# EAGLE board E-P-206-R1.2 Fuel Cell Control (Board to Board) (EAGLE 7.4.0), part 1 of 2
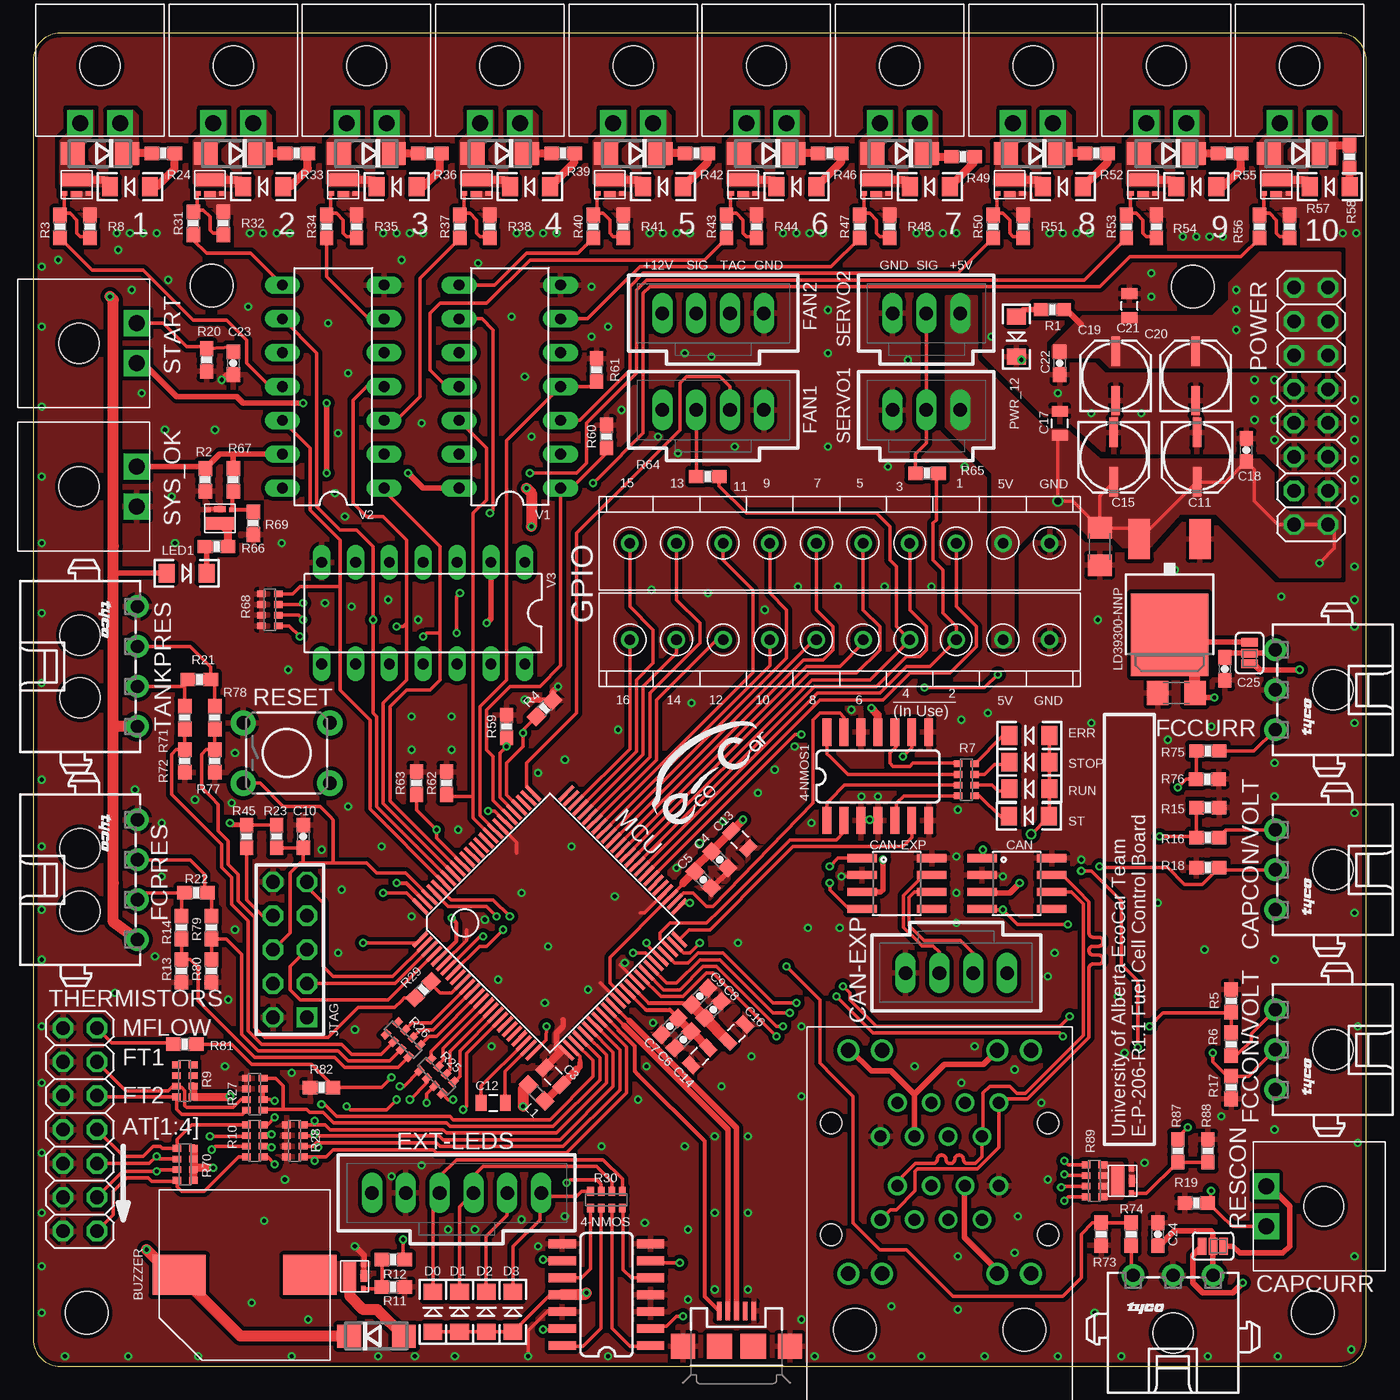
[diagram p5: board, top side]
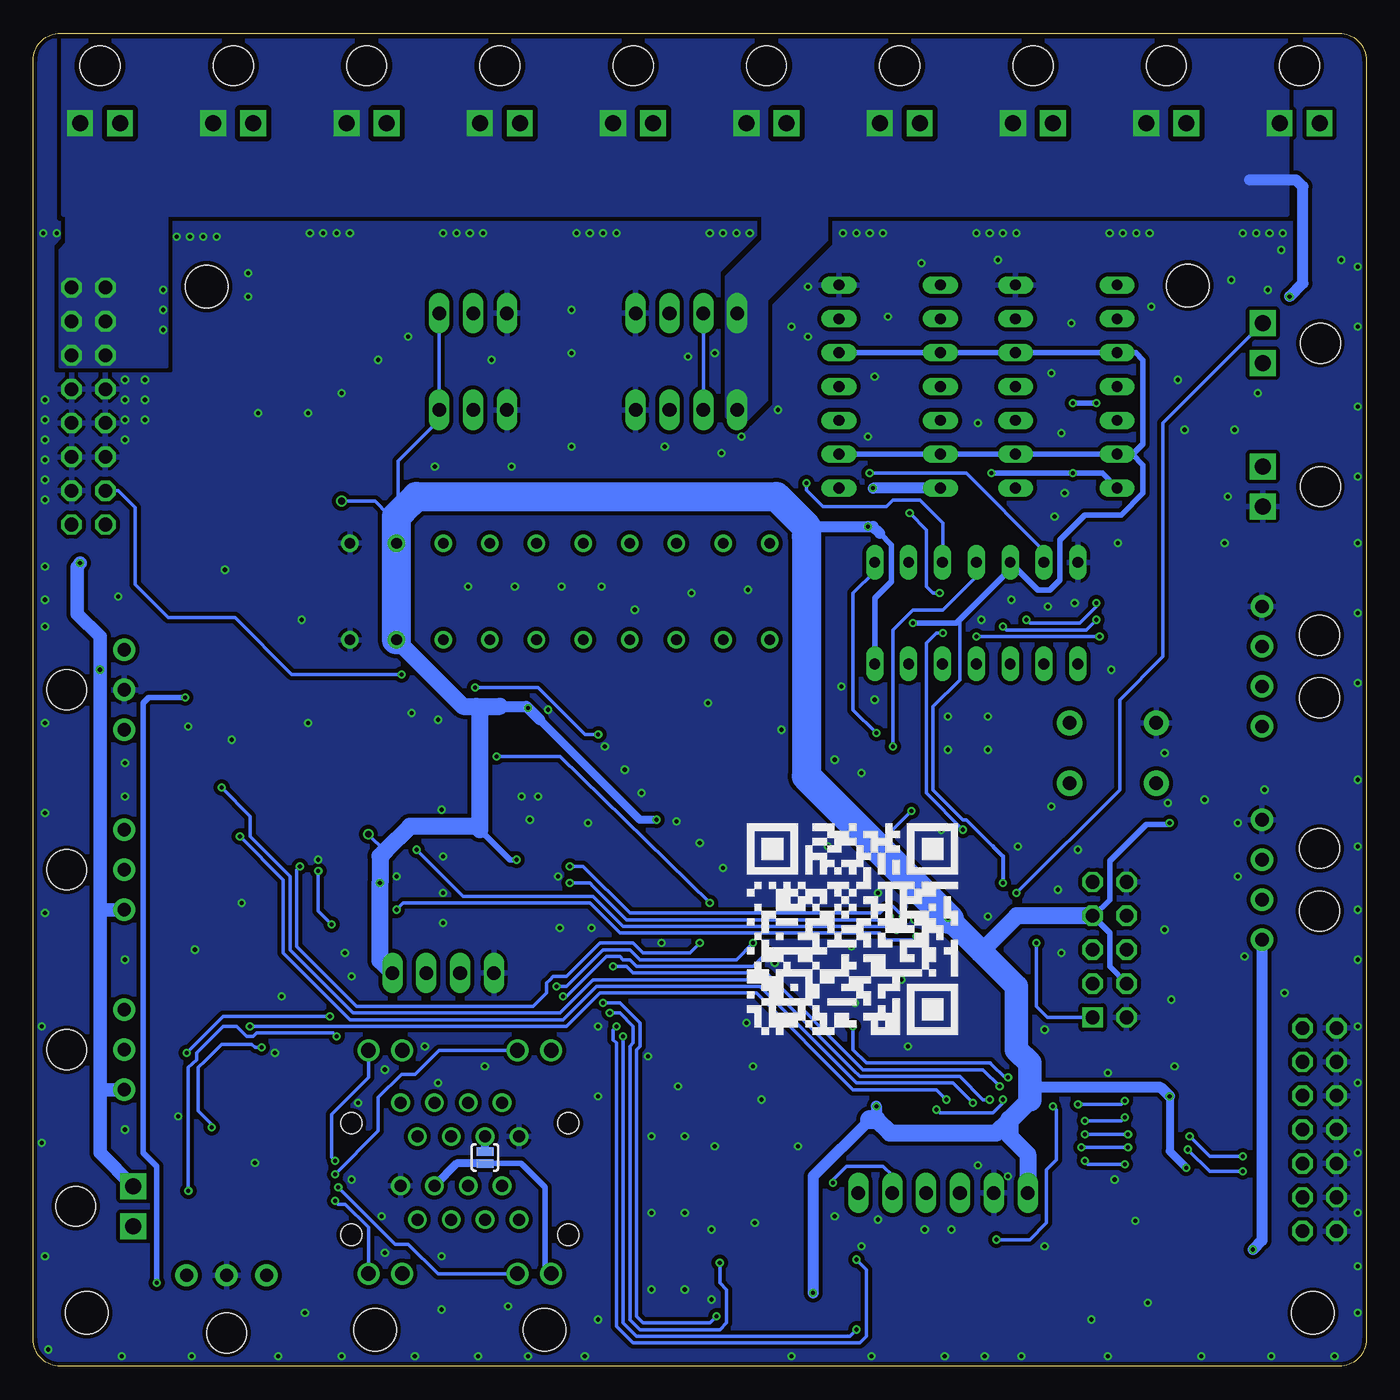
[diagram p6: board, bottom side, seen from below]

Size 100 x 100 mm. Coordinates in mm from the lower left corner, seen from the top.
Outline: 0,98 0,2 arc90 2,0 98,0 arc90 100,2 100,98 arc90 98,100 2,100 arc90 0,98
Copper layers (1*16): Top 0.035mm / dielectric 1.5mm / Bottom 0.035mm
Design rules "SeeedStudio_2layer_DRU_no_angle_20140221": minimum track width 6mil, minimum drill 12mil, track to track 6mil, track to pad 6mil, pad to pad 6mil, via to via 6mil, smd to smd 0mil, copper to edge 10mil, drill to drill 10mil, minimum pad ring 10mil, minimum via ring 6mil, stop-mask expansion 2mil, vias tented up to drill 100mil, thermal gap 10mil
Holes 3.2 mm at 4,4 96,4 13.37,81.08 87,81

## Footprints (pad centres in the part's own frame; a part is rotated, then mirrored left to right if it is on the bottom)
SOIC-14 = smd 0.66 x 2.032: 1 -4.445,-3.315; 2 -3.175,-3.315; 3 -1.905,-3.315; 4 -0.635,-3.315; 5 0.635,-3.315; 6 1.905,-3.315; 7 3.175,-3.315; 8 3.175,3.315; 9 1.905,3.315; 10 0.635,3.315; 11 -0.635,3.315; 12 -1.905,3.315; 13 -3.175,3.315; 14 -4.445,3.315
CT-1212CL-SMT = smd 4 x 3: + -4.9,0; - 4.9,0
1206 = smd 1.6 x 1.8: 1 -1.4,0; 2 1.4,0
0805 = smd 0.8 x 1.2: 1 -0.9,0; 2 0.9,0
0603-CAP = smd 1.1 x 1: 1 -0.85,0; 2 0.85,0
PANASONIC_C = smd 2.2 x 0.65: + 1.9,-0.2; - -1.8,-0.2
70543-04 = drill 1.016 long: 1 -3.81,0; 2 -1.27,0; 3 1.27,0; 4 3.81,0
1445055-3 = drill 1 pad 1.676: 1 3,4.32; 2 0,4.32; 3 -3,4.32 | hole 3: 0,0
LED-1206 = smd 1.2 x 1.4: A -1.5,0; C 1.5,0
70543-06 = drill 1.016 long: 1 -6.35,0; 2 -3.81,0; 3 -1.27,0; 4 1.27,0; 5 3.81,0; 6 6.35,0
1445055-4 = drill 1 pad 1.676: 1 4.5,4.32; 2 1.5,4.32; 3 -1.5,4.32; 4 -4.5,4.32 | hole 3: -2.35,0; 2.35,0
SJ_3_PASTE1&2 = smd 0.635 x 1.27: 1 -0.813,0; 2 0,0; 3 0.813,0
USB-MICROB = smd 0.35 x 1.4: D+ 0,2.65; D- -0.65,2.65; GND 1.3,2.65; ID 0.65,2.65; VBUS -1.3,2.65 | smd 1.8 x 1.9: MT1 -4,0; MT2 4,0 | smd 1.9 x 1.9: P$1 -1.27,0; P$2 1.27,0
SJ_2S-NO = smd 0.635 x 1.27: 1 -0.45,0; 2 0.45,0
AVR-JTAG-10 = drill 1.016 square: 1 -5.08,-1.27 | drill 1.016 octagon: 2 -5.08,1.27; 3 -2.54,-1.27; 4 -2.54,1.27; 5 0,-1.27; 6 0,1.27; 7 2.54,-1.27; 8 2.54,1.27; 9 5.08,-1.27; 10 5.08,1.27
0603 = smd 1.1 x 1: 1 -0.85,0; 2 0.85,0
DPACK = smd 1.6 x 3: 1 -2.28,-4.8; 3 2.28,-4.8 | smd 5.8 x 6.2: 4 0,2.38
TQFP100 = smd 0.27 x 1.5: 1 -6,-7.75; 2 -5.5,-7.75; 3 -5,-7.75; 4 -4.5,-7.75; 5 -4,-7.75; 6 -3.5,-7.75; 7 -3,-7.75; 8 -2.5,-7.75; 9 -2,-7.75; 10 -1.5,-7.75; 11 -1,-7.75; 12 -0.5,-7.75; 13 0,-7.75; 14 0.5,-7.75; 15 1,-7.75; 16 1.5,-7.75; 17 2,-7.75; 18 2.5,-7.75; 19 3,-7.75; 20 3.5,-7.75; 21 4,-7.75; 22 4.5,-7.75; 23 5,-7.75; 24 5.5,-7.75; 25 6,-7.75; 51 6,7.75; 52 5.5,7.75; 53 5,7.75; 54 4.5,7.75; 55 4,7.75; 56 3.5,7.75; 57 3,7.75; 58 2.5,7.75; 59 2,7.75; 60 1.5,7.75; 61 1,7.75; 62 0.5,7.75; 63 0,7.75; 64 -0.5,7.75; 65 -1,7.75; 66 -1.5,7.75; 67 -2,7.75; 68 -2.5,7.75; 69 -3,7.75; 70 -3.5,7.75; 71 -4,7.75; 72 -4.5,7.75; 73 -5,7.75; 74 -5.5,7.75; 75 -6,7.75 | smd 1.5 x 0.27: 26 7.75,-6; 27 7.75,-5.5; 28 7.75,-5; 29 7.75,-4.5; 30 7.75,-4; 31 7.75,-3.5; 32 7.75,-3; 33 7.75,-2.5; 34 7.75,-2; 35 7.75,-1.5; 36 7.75,-1; 37 7.75,-0.5; 38 7.75,0; 39 7.75,0.5; 40 7.75,1; 41 7.75,1.5; 42 7.75,2; 43 7.75,2.5; 44 7.75,3; 45 7.75,3.5; 46 7.75,4; 47 7.75,4.5; 48 7.75,5; 49 7.75,5.5; 50 7.75,6; 76 -7.75,6; 77 -7.75,5.5; 78 -7.75,5; 79 -7.75,4.5; 80 -7.75,4; 81 -7.75,3.5; 82 -7.75,3; 83 -7.75,2.5; 84 -7.75,2; 85 -7.75,1.5; 86 -7.75,1; 87 -7.75,0.5; 88 -7.75,0; 89 -7.75,-0.5; 90 -7.75,-1; 91 -7.75,-1.5; 92 -7.75,-2; 93 -7.75,-2.5; 94 -7.75,-3; 95 -7.75,-3.5; 96 -7.75,-4; 97 -7.75,-4.5; 98 -7.75,-5; 99 -7.75,-5.5; 100 -7.75,-6
2X08 = drill 1.016 octagon: 1 -8.89,-1.27; 2 -8.89,1.27; 3 -6.35,-1.27; 4 -6.35,1.27; 5 -3.81,-1.27; 6 -3.81,1.27; 7 -1.27,-1.27; 8 -1.27,1.27; 9 1.27,-1.27; 10 1.27,1.27; 11 3.81,-1.27; 12 3.81,1.27; 13 6.35,-1.27; 14 6.35,1.27; 15 8.89,-1.27; 16 8.89,1.27
0603-RES = smd 1.1 x 1: 1 -0.85,0; 2 0.85,0
0603-ARV = smd 0.5 x 0.65: 1 -1.2,-0.625; 2 -0.4,-0.625; 3 0.4,-0.625; 4 1.2,-0.625; 5 1.2,0.625; 6 0.4,0.625; 7 -0.4,0.625; 8 -1.2,0.625
43650-0200 = drill 1.2 pad 1.93 square: P$1 -1.5,0; P$2 1.5,0 | hole 3: 0,-4.32
TACTILE-PTH = drill 1.016 pad 1.88: 1 -3.251,2.261; 2 3.251,2.261; 3 -3.251,-2.261; 4 3.251,-2.261
70543-03 = drill 1.016 long: 1 -2.54,0; 2 0,0; 3 2.54,0
2X07 = drill 1.016 octagon: 1 -7.62,-1.27; 2 -7.62,1.27; 3 -5.08,-1.27; 4 -5.08,1.27; 5 -2.54,-1.27; 6 -2.54,1.27; 7 0,-1.27; 8 0,1.27; 9 2.54,-1.27; 10 2.54,1.27; 11 5.08,-1.27; 12 5.08,1.27; 13 7.62,-1.27; 14 7.62,1.27
2XETHERNET = drill 0.9: B_1 -4.44,8.25; B_2 -3.17,10.79; B_3 -1.9,8.25; B_4 -0.63,10.79; B_5 0.64,8.25; B_6 1.91,10.79; B_7 3.18,8.25; B_8 4.45,10.79; T_1 4.45,17.02; T_2 3.18,14.48; T_3 1.91,17.02; T_4 0.64,14.48; T_5 -0.63,17.02; T_6 -1.9,14.48; T_7 -3.17,17.02; T_8 -4.44,14.48 | drill 1.1: B_9 -6.86,4.19; B_10 -4.32,4.19; B_11 4.32,4.19; B_12 6.86,4.19; T_9 -6.86,20.95; T_10 -4.32,20.95; T_11 4.32,20.95; T_12 6.86,20.95 | hole 3.2: -6.35,0; 6.35,0 | hole 1.6: -8.13,15.49; 8.13,15.49; -8.13,7.11; 8.13,7.11
10X1PCBBLOCK = drill 0.8: 1 -15.75,0; 2 -12.25,0; 3 -8.75,0; 4 -5.25,0; 5 -1.75,0; 6 1.75,0; 7 5.25,0; 8 8.75,0; 9 12.25,0; 10 15.75,0
8-SOIC = smd 0.61 x 2.21: 1 0.635,-0.076; 2 1.905,-0.076; 3 3.175,-0.076; 4 4.445,-0.076; 5 4.445,5.156; 6 3.175,5.156; 7 1.905,5.156; 8 0.635,5.156
SC70-6L = smd 0.95 x 2.4: D 0,0 | smd 0.35 x 0.5: G 1.01,-0.95; S@0 1.01,0.95 | smd 0.45 x 0.87: S@1 1.05,0
DO214AC = smd 1.8 x 1.7: A 2.05,0; C -2.05,0
DIL14 = drill 0.813 long: 1 -7.62,-3.81; 2 -5.08,-3.81; 3 -2.54,-3.81; 4 0,-3.81; 5 2.54,-3.81; 6 5.08,-3.81; 7 7.62,-3.81; 8 7.62,3.81; 9 5.08,3.81; 10 2.54,3.81; 11 0,3.81; 12 -2.54,3.81; 13 -5.08,3.81; 14 -7.62,3.81

## Placement (x,y rotation side)
4-NMOS  ALD1106PBL  [SOIC-14]  43,6 90 top
4-NMOS1  ALD1106PBL  [SOIC-14]  64,44.25 0 top
BUZZER  BUZZER-CT-1212CL-SMT  [CT-1212CL-SMT]  15.85,6.85 0 top
C1  NNP  [1206]  80,61.5 270 top
C2  NNP  [1206]  85.75,50.5 180 top
C3  100uF  [0805]  39,21.75 135 top
C4  100nF  [0603-CAP]  51.5,38 315 top
C5  1nF  [0603-CAP]  50.25,36.5 315 top
C6  100nF  [0603-CAP]  48.75,24.5 225 top
C7  470pF  [0603-CAP]  47.75,25.5 225 top
C8  100nF  [0603-CAP]  51,26.75 45 top
C9  470pF  [0603-CAP]  50,27.75 45 top
C10  22nF  [0603-CAP]  20.25,39.75 270 top
C11  100uF  [PANASONIC_C]  87.5,68.25 270 top
C12  100nF  [0805]  34.5,19.75 0 top
C13  4.7uF  [0805]  53,39.5 315 top
C14  4.7uF  [0805]  50,23.25 225 top
C15  100uF  [PANASONIC_C]  81.25,68.25 270 top
C16  2.2uF  [0805]  52.75,25 45 top
C17  1uF  [0805]  77,70.75 90 top
C18  10nF  [0603-CAP]  91,68.75 90 top
C19  100uF  [PANASONIC_C]  81,74.25 90 top
C20  100uF  [PANASONIC_C]  87,74.25 90 top
C21  1uF  [0805]  82.23,79.56 90 top
C22  10nF  [0603-CAP]  77,75.25 270 top
C23  100nF  [0603-CAP]  15,75.25 270 top
C24  100nF  [0603-CAP]  84.37,9.91 90 top
C25  100nF  [0603-CAP]  89.39,52.32 270 top
CAN-EXP  C-GRID-04-70543  [70543-04]  69.25,29.5 180 top
CAPCON/VOLT  1445055-3  [1445055-3]  97.5,37.25 90 top
CAPCURR  1445055-3  [1445055-3]  85.5,2.5 0 top
D0  [LED-1206]  29.98,4.06 90 top
D1  [LED-1206]  31.98,4.06 90 top
D2  [LED-1206]  33.98,4.06 90 top
D3  [LED-1206]  35.98,4.06 90 top
EXT-LEDS  C-GRID-06-70543  [70543-06]  31.75,13 0 top
FAN1  C-GRID-04-70543  [70543-04]  51,71.75 0 top
FAN2  C-GRID-04-70543  [70543-04]  51,79 0 top
FCCON/VOLT  1445055-3  [1445055-3]  97.5,23.75 90 top
FCCURR  1445055-3  [1445055-3]  97.5,50.75 90 top
FCPRES  1445055-4  [1445055-4]  3.5,36.5 270 top
JP1  JUMPER-31-2  [SJ_3_PASTE1&2]  88.5,9 180 top
JP2  USB  [USB-MICROB]  52.75,1.5 0 top
JP3  JUMPER-31-2  [SJ_3_PASTE1&2]  91.25,53.5 90 top
JP4  [SJ_2S-NO]  66.12,15.66 270 bottom
JTAG  2x5  [AVR-JTAG-10]  19.25,31.25 90 top
L1  BLM18KG221SN1D  [0603]  37.75,20.5 135 top
LD39300-NNP  LD117ADT50TR  [DPACK]  85.25,57.25 180 top
LED1  [LED-1206]  11.5,59.5 0 top
LED6  [LED-1206]  7.25,88.5 180 top
LED7  [LED-1206]  17.25,88.5 180 top
LED8  [LED-1206]  27.25,88.5 180 top
LED9  [LED-1206]  37.25,88.5 180 top
LED10  [LED-1206]  47.25,88.5 180 top
LED11  [LED-1206]  57.25,88.5 180 top
LED12  [LED-1206]  67.25,88.5 180 top
LED13  [LED-1206]  77.25,88.5 180 top
LED14  [LED-1206]  87.25,88.5 180 top
LED15  [LED-1206]  97.25,88.5 180 top
LERROR  RED  [LED-1206]  74.73,47.31 180 top
LRUN  GREEN  [LED-1206]  74.73,43.31 180 top
LSTART  BLUE  [LED-1206]  74.71,41.27 180 top
LSTOP  YELLOW  [LED-1206]  74.73,45.31 180 top
MCU  AT32UC3C1512  [TQFP100]  38.75,33.25 315 top
POWER  [2X08]  95.87,72.03 270 top
PWR_12  GREEN  [LED-1206]  73.75,77.25 270 top
R1  1k  [0603-RES]  76.46,79.27 0 top
R2  10k\  [0603-RES]  12.9,66.5 90 top
R3  1k  [0603-RES]  2,85.5 90 top
R4  10k  [0603-RES]  38.35,49.35 45 top
R5  3k 1%  [0603-RES]  89.87,27.41 90 top
R6  47k 1%  [0603-RES]  89.87,24.16 90 top
R7  470  [0603-ARV]  70,44 270 top
R8  10k  [0603-RES]  4.25,85.5 270 top
R9  100k  [0603-ARV]  11.37,21.41 90 top
R10  10k  [0603-ARV]  16.62,16.91 270 top
R11  10k  [0603-RES]  27,5.95 180 top
R12  1k  [0603-RES]  27,8 180 top
R13  47k 1%  [0603-RES]  11.12,29.66 90 top
R14  31.6k 1%  [0603-RES]  11.12,32.91 90 top
R15  3k 1%  [0603-RES]  88.12,41.91 0 top
R16  47k 1%  [0603-RES]  88.12,39.66 180 top
R17  4.7k  [0603-RES]  89.87,20.91 270 top
R18  4.7k  [0603-RES]  88.12,37.41 180 top
R19  4.7k  [0603-RES]  87.25,12.25 180 top
R20  4.7k  [0603-RES]  13,75.5 270 top
R21  10k  [0603-RES]  12.46,51.52 180 top
R22  10k  [0603-RES]  12.21,35.52 180 top
R23  10k  [0603-RES]  18.25,39.75 90 top
R24  1k  [0603-RES]  9.75,91 180 top
R25  10k  [0603-ARV]  30.25,21.75 135 top
R26  10k  [0603-ARV]  27.75,24.5 135 top
R27  10k  [0603-ARV]  16.62,20.41 270 top
R28  10k  [0603-ARV]  19.62,16.91 270 top
R29  10k  [0603-RES]  29.25,28.25 45 top
R30  470  [0603-ARV]  43,12.5 0 top
R31  1k  [0603-RES]  12,85.75 90 top
R32  10k  [0603-RES]  14.25,85.75 270 top
R33  1k  [0603-RES]  19.75,91 180 top
R34  1k  [0603-RES]  22,85.5 90 top
R35  10k  [0603-RES]  24.25,85.5 270 top
R36  1k  [0603-RES]  29.75,91 180 top
R37  1k  [0603-RES]  32,85.5 90 top
R38  10k  [0603-RES]  34.25,85.5 270 top
R39  1k  [0603-RES]  39.75,91 180 top
R40  1k  [0603-RES]  42,85.5 90 top
R41  10k  [0603-RES]  44.25,85.5 270 top
R42  1k  [0603-RES]  49.75,91 180 top
R43  1k  [0603-RES]  52,85.5 90 top
R44  10k  [0603-RES]  54.25,85.5 270 top
R45  10k  [0603-RES]  16,39.75 90 top
R46  1k  [0603-RES]  59.75,91 180 top
R47  1k  [0603-RES]  62,85.5 90 top
R48  10k  [0603-RES]  64.25,85.5 270 top
R49  1k  [0603-RES]  69.75,90.75 180 top
R50  1k  [0603-RES]  72,85.5 90 top
R51  10k  [0603-RES]  74.25,85.5 270 top
R52  1k  [0603-RES]  79.75,91 180 top
R53  1k  [0603-RES]  82,85.5 90 top
R54  10k  [0603-RES]  84.25,85.5 270 top
R55  1k  [0603-RES]  89.75,91 180 top
R56  1k  [0603-RES]  92,85.5 90 top
R57  10k  [0603-RES]  94.25,85.5 270 top
R58  1k  [0603-RES]  98.75,90.75 90 top
R59  10k  [0603-RES]  35.5,48 90 top
R60  10k  [0603-RES]  43,69.75 90 top
R61  10k  [0603-RES]  42.25,74.75 90 top
R62  10k  [0603-RES]  31,43.75 90 top
R63  10k  [0603-RES]  28.75,43.75 90 top
R64  10k  [0603-RES]  50.6,66.75 180 top
R65  10k  [0603-RES]  67.05,67 180 top
R66  1k  [0603-RES]  13.75,61.5 0 top
R67  1k  [0603-RES]  15,66.5 270 top
R68  10k  [0603-ARV]  17.75,56.75 90 top
R69  10k  [0603-RES]  16.5,63.25 90 top
R70  100k  [0603-ARV]  11.4,15.15 90 top
R71  31.6k 1%  [0603-RES]  11.37,48.66 90 top
R72  47k 1%  [0603-RES]  11.37,45.41 90 top
R73  47k 1%  [0603-RES]  80.12,9.91 90 top
R74  31.6k 1%  [0603-RES]  82.37,9.91 270 top
R75  31.6k 1%  [0603-RES]  88.12,46.16 0 top
R76  47k 1%  [0603-RES]  88.08,44.04 180 top
R77  31.6k 1%  [0603-RES]  13.62,48.66 90 top
R78  47k 1%  [0603-RES]  13.62,45.41 90 top
R79  31.6k 1%  [0603-RES]  13.37,32.91 90 top
R80  47k 1%  [0603-RES]  13.37,29.66 90 top
R81  31.6k 1%  [0603-RES]  11.37,24.16 180 top
R82  47k 1%  [0603-RES]  21.62,20.91 0 top
R87  1k  [0603-RES]  85.87,16.16 90 top
R88  10k  [0603-RES]  88.12,16.16 90 top
R89  1k  [0603-ARV]  79.62,13.91 90 top
RESCON  43650-0200  [43650-0200]  92.5,12 90 top
RESET  SWITCH-MOMENTARY-2PTH  [TACTILE-PTH]  19,46 0 top
SERVO1  C-GRID-03-70543  [70543-03]  67,71.75 0 top
SERVO2  C-GRID-03-70543  [70543-03]  67,79 0 top
START  43650-0200  [43650-0200]  7.75,76.75 270 top
SYS_OK  43650-0200  [43650-0200]  7.75,66 270 top
TANKPRES  1445055-4  [1445055-4]  3.5,52.5 270 top
THERMISTORS  [2X07]  3.5,17.75 90 top
U$1  2XETHERNET  [2XETHERNET]  68,2.75 0 top
U$2  10X1PCBBLOCK  [10X1PCBBLOCK]  60.5,61.75 0 top
U$3  10X1PCBBLOCK  [10X1PCBBLOCK]  60.5,54.5 180 top
U$4  MCP2551  [8-SOIC]  71.25,38.75 270 top
U$5  SIA448DJ-T1  [SC70-6L]  3.25,89 270 top
U$6  43650-0200  [43650-0200]  5,93.25 180 top
U$7  [DO214AC]  5,91 180 top
U$8  SIA448DJ-T1  [SC70-6L]  13.25,89 270 top
U$9  43650-0200  [43650-0200]  15,93.25 180 top
U$10  [DO214AC]  15,91 180 top
U$11  SIA448DJ-T1  [SC70-6L]  23.25,89 270 top
U$12  43650-0200  [43650-0200]  25,93.25 180 top
U$13  [DO214AC]  25,91 180 top
U$14  SIA448DJ-T1  [SC70-6L]  33.25,89 270 top
U$15  43650-0200  [43650-0200]  35,93.25 180 top
U$16  [DO214AC]  35,91 180 top
U$17  SIA448DJ-T1  [SC70-6L]  43.25,89 270 top
U$18  43650-0200  [43650-0200]  45,93.25 180 top
U$19  [DO214AC]  45,91 180 top
U$20  SIA448DJ-T1  [SC70-6L]  53.25,89 270 top
U$21  43650-0200  [43650-0200]  55,93.25 180 top
U$22  [DO214AC]  55,91 180 top
U$23  SIA448DJ-T1  [SC70-6L]  63.25,89 270 top
U$24  43650-0200  [43650-0200]  65,93.25 180 top
U$25  [DO214AC]  65,91 180 top
U$26  SIA448DJ-T1  [SC70-6L]  73.25,89 270 top
U$27  43650-0200  [43650-0200]  75,93.25 180 top
U$28  [DO214AC]  75,91 180 top
U$29  SIA448DJ-T1  [SC70-6L]  83.25,89 270 top
U$30  43650-0200  [43650-0200]  85,93.25 180 top
U$31  [DO214AC]  85,91 180 top
U$32  SIA448DJ-T1  [SC70-6L]  93.25,89 270 top
U$33  43650-0200  [43650-0200]  95,93.25 180 top
U$34  [DO214AC]  94.75,91 180 top
U$35  SIA448DJ-T1  [SC70-6L]  14,63.25 90 top
U$36  MCP2551  [8-SOIC]  62.25,38.75 270 top
U$37  SIA448DJ-T1  [SC70-6L]  23.75,6.75 0 top
U$38  [DO214AC]  25.75,2.25 0 top
U$39  SIA448DJ-T1  [SC70-6L]  81.37,13.91 0 top
V1  SN74HC08N  [DIL14]  35.75,73.5 90 top
V2  SN74HC08N  [DIL14]  22.5,73.5 90 top
V3  SN74HC08N  [DIL14]  29.25,56.5 180 top